# EAGLE schematic motor_sub_module (EAGLE 7.6.0)
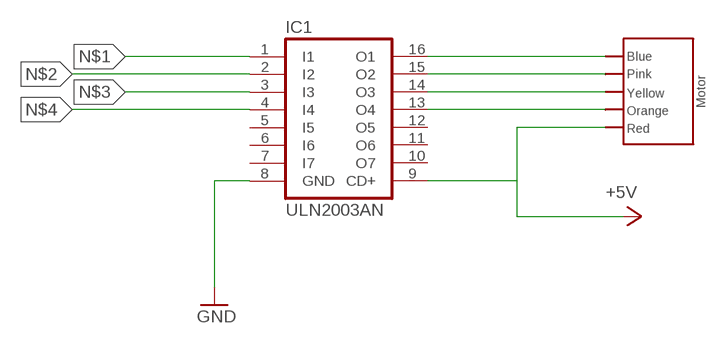
[diagram p0: schematic, sheet 1]

## Parts
IC1  ULN2003AN  [DIL16]
U$1  MOTOR  [MOTOR]

## Nets
+5V: IC1.9(CD+)
GND: IC1.8(GND)
N$1: IC1.1(I1)
N$2: IC1.2(I2)
N$3: IC1.3(I3)
N$4: IC1.4(I4)
N$7: IC1.16(O1)
N$8: IC1.15(O2)
N$9: IC1.14(O3)
N$10: IC1.13(O4)
Unconnected: IC1.5(I5) IC1.6(I6) IC1.7(I7) IC1.10(O7) IC1.11(O6) IC1.12(O5)

## Library data of the parts
IC1 = uln-udn:ULN2003A: DRIVER ARRAY
U$1 = stepper_for_ULN2003:MOTOR